# EAGLE design heliostat (EAGLE 7.3.0)
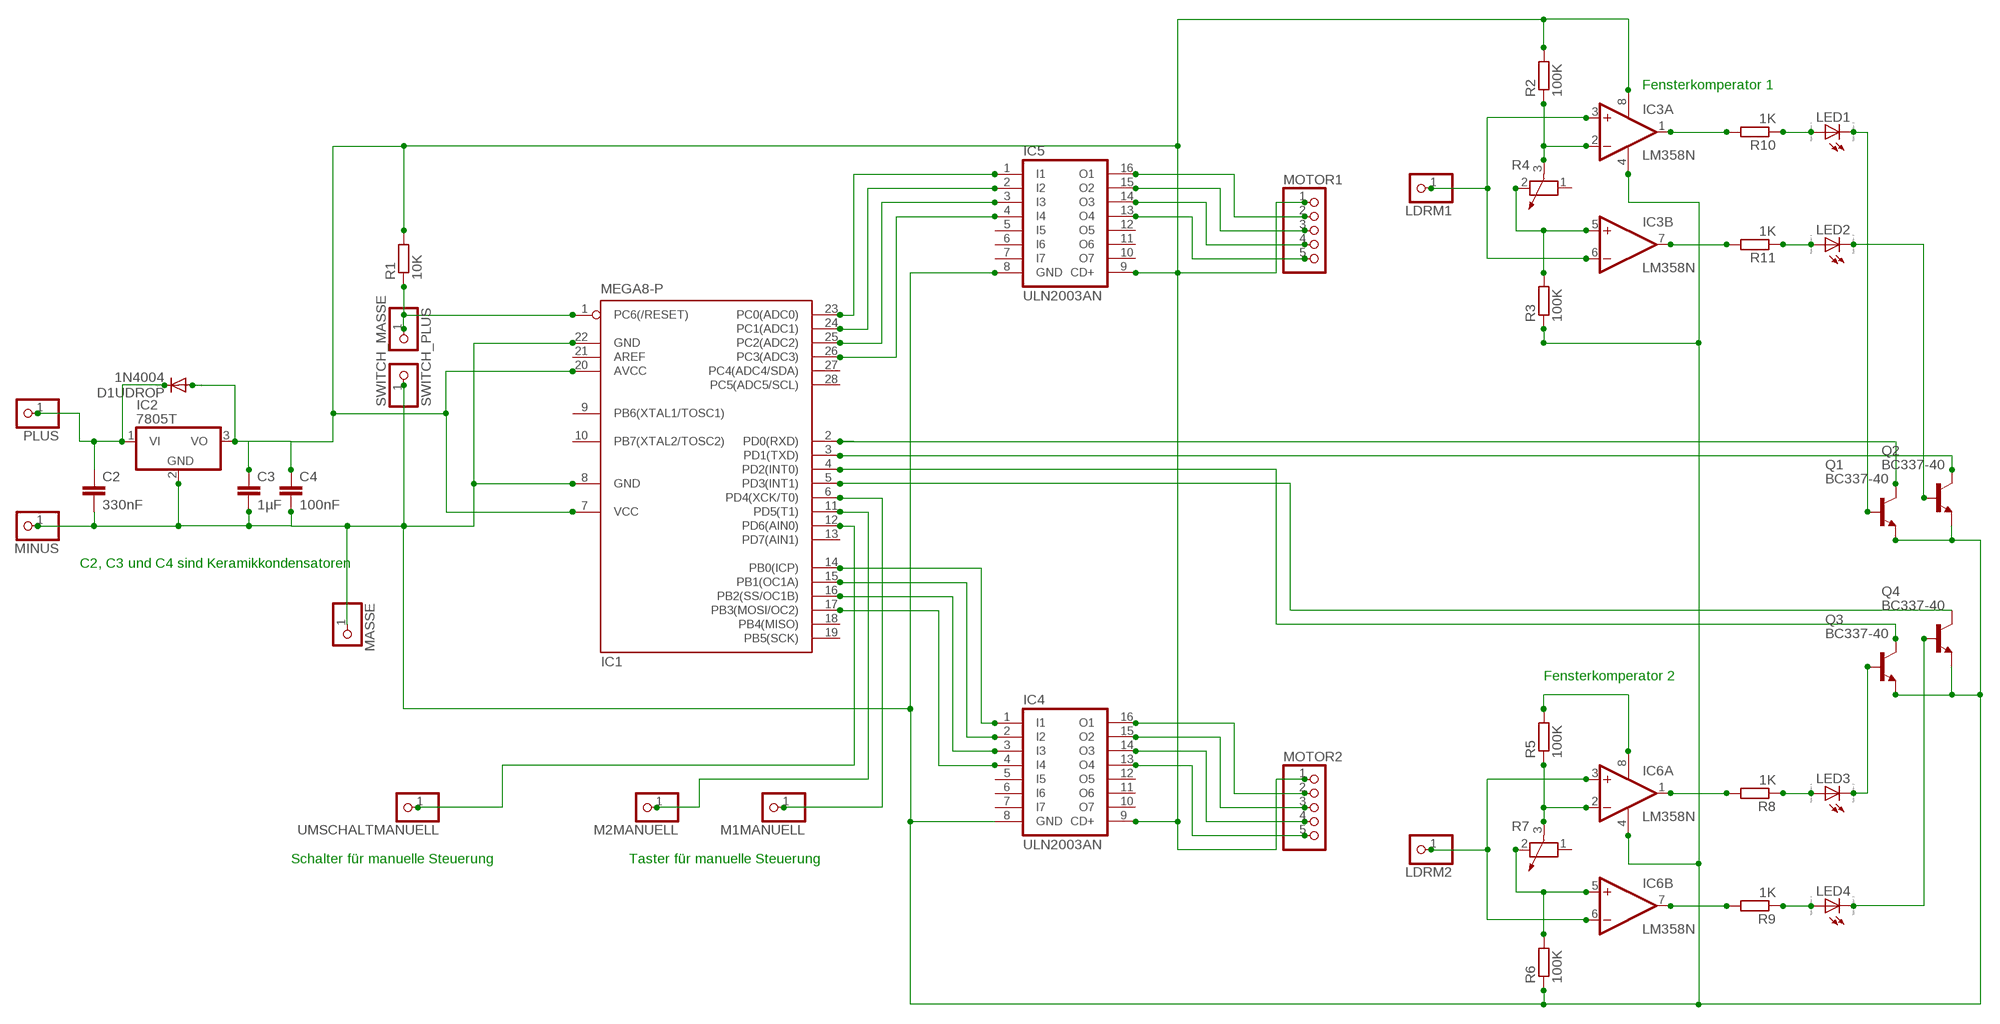
[diagram p0: schematic, sheet 1]

## Parts
C2  330nF  C-EU025-024X044  [C025-024X044]
C3  1µF  C-EU025-024X044  [C025-024X044]
C4  100nF  C-EU025-024X044  [C025-024X044]
D1UDROP  1N4004  [DO41-10]
IC1  MEGA8-P  [DIL28-3]
IC2  7805T  [TO220H]
IC3  LM358N  [DIL08]
IC4  ULN2003AN  [DIL16]
IC5  ULN2003AN  [DIL16]
IC6  LM358N  [DIL08]
LDRM1  PINHD-1X1  [1X01]
LDRM2  PINHD-1X1  [1X01]
LED1  LED_ELD260  [LED_LD260]
LED2  LED_ELD260  [LED_LD260]
LED3  LED_ELD260  [LED_LD260]
LED4  LED_ELD260  [LED_LD260]
M1MANUELL  PINHD-1X1  [1X01]
M2MANUELL  PINHD-1X1  [1X01]
MASSE  PINHD-1X1  [1X01]
MINUS  PINHD-1X1  [1X01]
MOTOR1  PINHD-1X5  [1X05]
MOTOR2  PINHD-1X5  [1X05]
PLUS  PINHD-1X1  [1X01]
Q1  BC337-40  [TO92]
Q2  BC337-40  [TO92]
Q3  BC337-40  [TO92]
Q4  BC337-40  [TO92]
R1  10K  R-EU_0204/2V  [0204V]
R2  100K  R-EU_0204/2V  [0204V]
R3  100K  R-EU_0204/2V  [0204V]
R4  POTENTIOMETER_PT-10  [PT-10]
R5  100K  R-EU_0204/2V  [0204V]
R6  100K  R-EU_0204/2V  [0204V]
R7  POTENTIOMETER_PT-10  [PT-10]
R8  1K  R-EU_0204/2V  [0204V]
R9  1K  R-EU_0204/2V  [0204V]
R10  1K  R-EU_0204/2V  [0204V]
R11  1K  R-EU_0204/2V  [0204V]
SWITCH_MASSE  PINHD-1X1  [1X01]
SWITCH_PLUS  PINHD-1X1  [1X01]
UMSCHALTMANUELL  PINHD-1X1  [1X01]

## Nets
N$1: IC1.23(PC0(ADC0)) IC5.1(I1)
N$2: IC3.2(A:-IN) R2.1 R4.3
N$3: IC1.24(PC1(ADC1)) IC5.2(I2)
N$4: C2.1 D1UDROP.C IC2.1(VI) PLUS.1
N$5: IC1.2(PD0(RXD)) Q1.3(C)
N$6: IC1.25(PC2(ADC2)) IC5.3(I3)
N$7: IC1.26(PC3(ADC3)) IC5.4(I4)
N$8: IC5.16(O1) MOTOR1.2
N$9: IC5.15(O2) MOTOR1.3
N$10: IC5.14(O3) MOTOR1.4
N$11: IC5.13(O4) MOTOR1.5
N$12: IC1.14(PB0(ICP)) IC4.1(I1)
N$13: IC1.15(PB1(OC1A)) IC4.2(I2)
N$14: IC1.16(PB2(SS/OC1B)) IC4.3(I3)
N$15: IC1.17(PB3(MOSI/OC2)) IC4.4(I4)
N$16: IC4.16(O1) MOTOR2.2
N$17: IC4.15(O2) MOTOR2.3
N$18: IC4.14(O3) MOTOR2.4
N$19: IC4.13(O4) MOTOR2.5
N$20: C3.1 C4.1 D1UDROP.A IC1.7(VCC) IC1.20(AVCC) IC2.3(VO) IC3.8(P:V+) IC4.9(CD+) IC5.9(CD+) MOTOR1.1 MOTOR2.1 R1.2 R2.2
N$21: IC3.5(B:+IN) R3.2 R4.2
N$22: IC6.8(P:V+) R5.2
N$23: IC3.3(A:+IN) IC3.6(B:-IN) LDRM1.1
N$24: IC6.1(A:OUT) R8.2
N$25: IC6.2(A:-IN) R5.1 R7.3
N$26: IC6.5(B:+IN) R6.2 R7.2
N$27: IC6.3(A:+IN) IC6.6(B:-IN) LDRM2.1
N$28: LED3.A R8.1
N$29: IC6.7(B:OUT) R9.2
N$30: LED4.A R9.1
N$31: IC3.7(B:OUT) R11.2
N$32: LED2.A R11.1
N$33: IC3.1(A:OUT) R10.2
N$34: LED1.A R10.1
N$35: IC1.1(PC6(/RESET)) R1.1 SWITCH_PLUS.1
N$36: IC1.6(PD4(XCK/T0)) M1MANUELL.1
N$37: LED1.K(C) Q1.2(B)
N$38: LED2.K(C) Q2.2(B)
N$39: IC1.3(PD1(TXD)) Q2.3(C)
N$40: LED3.K(C) Q3.2(B)
N$41: IC1.4(PD2(INT0)) Q3.3(C)
N$42: LED4.K(C) Q4.2(B)
N$43: IC1.5(PD3(INT1)) Q4.3(C)
N$44: IC1.11(PD5(T1)) M2MANUELL.1
N$45: C2.2 C3.2 C4.2 IC1.8(GND) IC1.22(GND) IC2.2(GND) IC3.4(P:V-) IC4.8(GND) IC5.8(GND) IC6.4(P:V-) MASSE.1 MINUS.1 Q1.1(E) Q2.1(E) Q3.1(E) Q4.1(E) R3.1 R6.1 SWITCH_MASSE.1
N$46: IC1.12(PD6(AIN0)) UMSCHALTMANUELL.1
Unconnected: IC1.9(PB6(XTAL1/TOSC1)) IC1.10(PB7(XTAL2/TOSC2)) IC1.13(PD7(AIN1)) IC1.18(PB4(MISO)) IC1.19(PB5(SCK)) IC1.21(AREF) IC1.27(PC4(ADC4/SDA)) IC1.28(PC5(ADC5/SCL)) IC4.5(I5) IC4.6(I6) IC4.7(I7) IC4.10(O7) IC4.11(O6) IC4.12(O5) IC5.5(I5) IC5.6(I6) IC5.7(I7) IC5.10(O7) IC5.11(O6) IC5.12(O5) R4.1 R7.1

## Notes on the sheet
- Fensterkomperator 1
- C2, C3 und C4 sind Keramikkondensatoren
- Fensterkomperator 2
- Schalter für manuelle Steuerung | Taster für manuelle Steuerung

## Library data of the parts
C2-C4 = rcl:C-EU: CAPACITOR, European symbol
D1UDROP = diode:1N4004: DIODE general purpose rectifier, 1 A
IC1 = atmel:MEGA8-P: MICROCONTROLLER 8 Kbytes FLASH, 1 kbytes SRAM, 512 bytes EEPROM, USART, 4-channel 10 bit ADC, 2-channel 8 bit ADC Pin compatible with Atmega48, ATMega88, ATMega168 Source: avr.lbr; OC_FARNELL: unknown; OC_NEWARK: unknown
IC2 = linear:78*: Positive VOLTAGE REGULATOR Source: http://cache.national.com/ds/LM/LM78L05.pdf http://www.fairchildsemi.com/ds/LM/LM7805.pdf
IC3 IC6 = linear:LM358: OP AMP also LM158; LM258; LM2904 Source: http://cache.national.com/ds/LM/LM158.pdf
IC4 IC5 = uln-udn:ULN2003A: DRIVER ARRAY
LDRM1 LDRM2 M1MANUELL M2MANUELL MASSE MINUS PLUS SWITCH_MASSE SWITCH_PLUS UMSCHALTMANUELL = pinhead:PINHD-1X1: PIN HEADER
LED1-LED4 = eagle-ltspice:LED_E: LED Source: http://www.osram.convergy.de Source: www.luxeon.com Source: www.kingbright.com; SPICEMODEL: NONE; SPICEPREFIX: D; SPICETYPE: diode
MOTOR1 MOTOR2 = pinhead:PINHD-1X5: PIN HEADER
Q1-Q4 = transistor-npn:BC337*: NPN Transistor
R1-R3 R5 R6 R8-R11 = resistor:R-EU_: RESISTOR, European symbol
R4 R7 = rcl:POTENTIOMETER_: Potentiometer

## Board
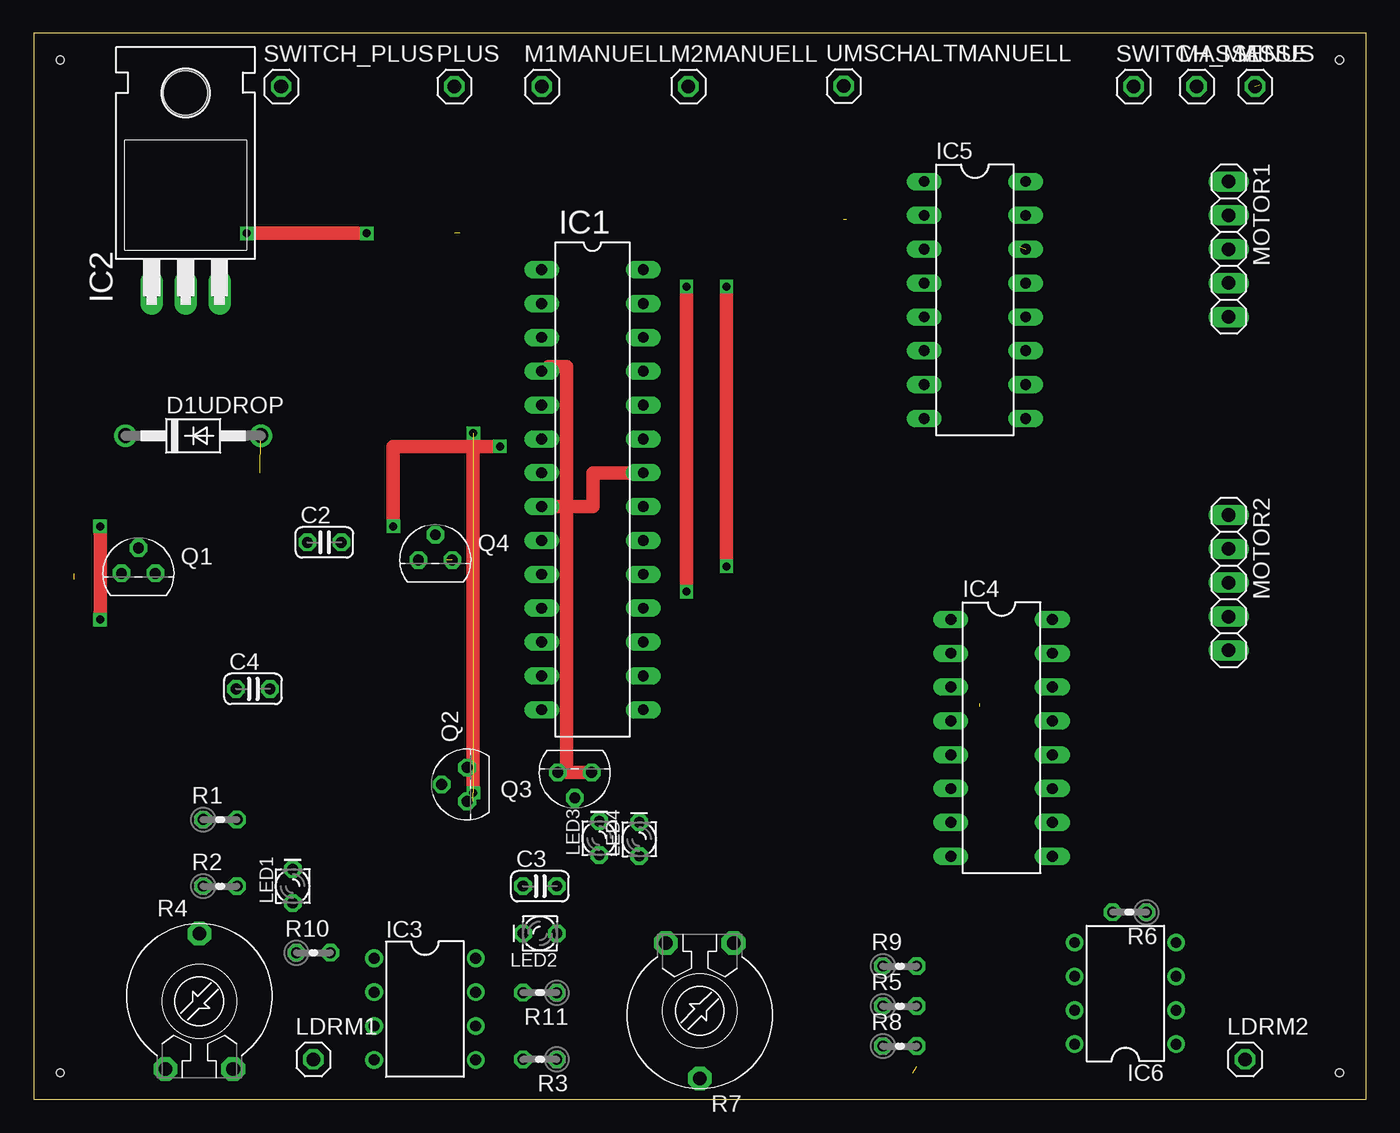
[diagram p1: board, top side]
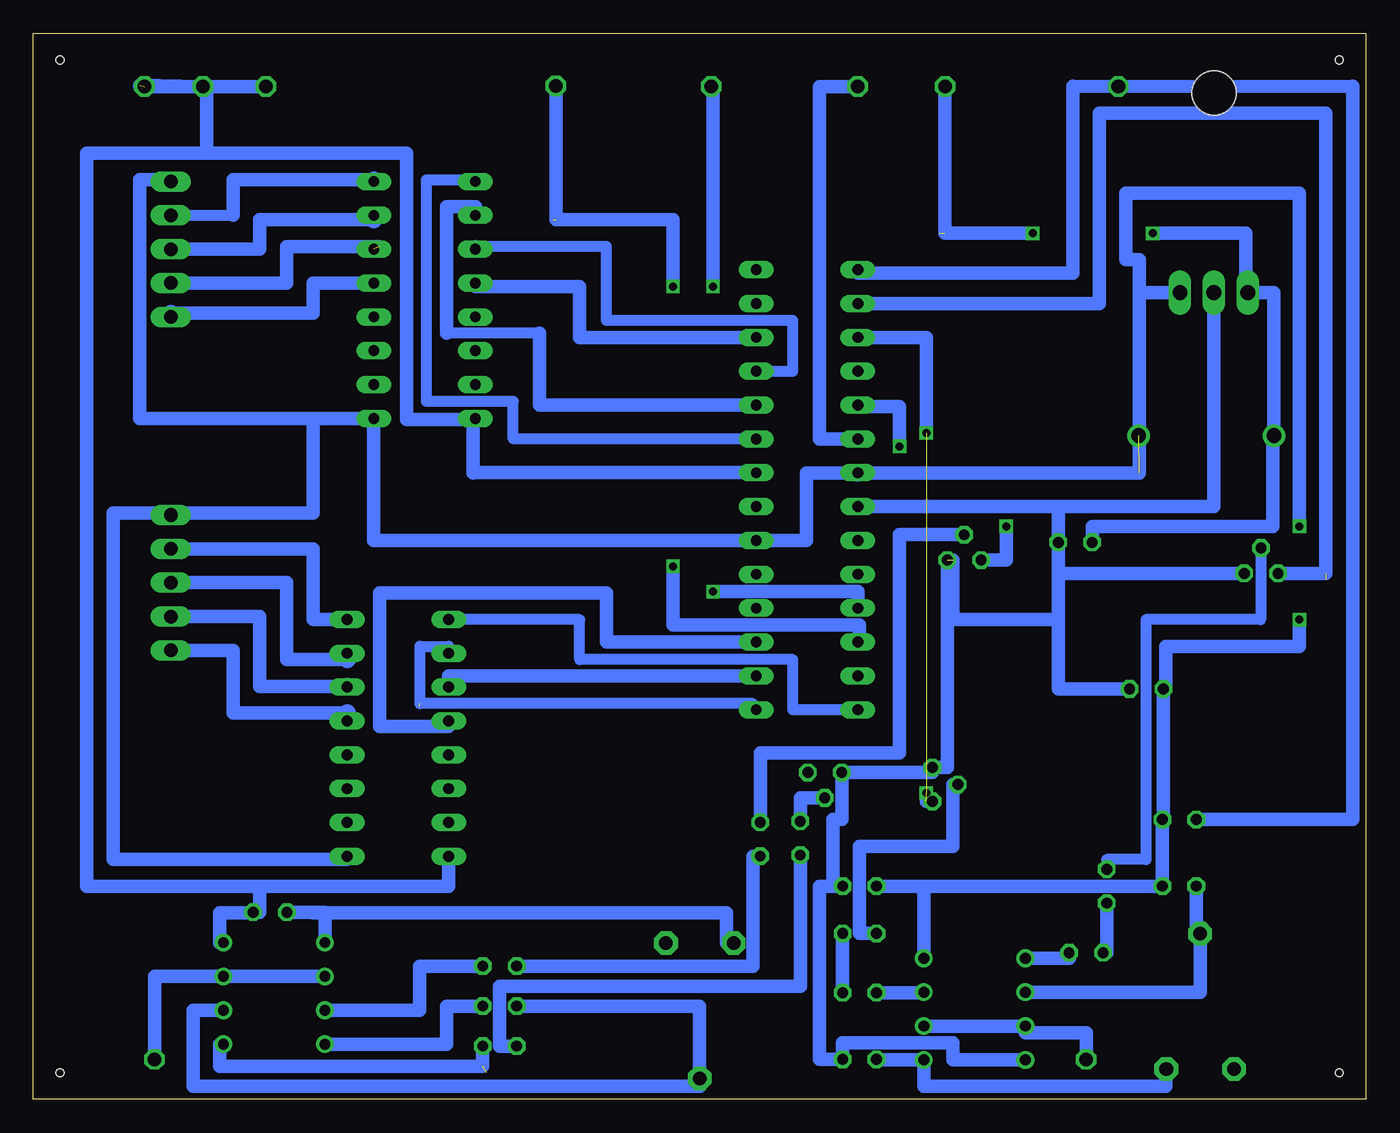
[diagram p2: board, bottom side, seen from below]

Size 100 x 80 mm. Coordinates in mm from the lower left corner, seen from the top.
Outline: 0,0 100,0 100,80 0,80 0,0
Copper layers (1*16): Top 0.035mm / dielectric 1.5mm / Bottom 0.035mm
Design rules "default": minimum track width 10mil, minimum drill 24mil, track to track 8mil, track to pad 8mil, pad to pad 8mil, via to via 8mil, smd to smd 8mil, copper to edge 40mil, drill to drill 8mil, minimum pad ring 10mil, minimum via ring 8mil, stop-mask expansion 4mil, vias tented up to drill 0mil, thermal gap 10mil
Holes 0.6 mm at 2,78 98,78 98,2 2,2

### Footprints (pad centres in the part's own frame; a part is rotated, then mirrored left to right if it is on the bottom)
C025-024X044 = drill 0.813 octagon: 1 -1.27,0; 2 1.27,0
DO41-10 = drill 1.118: A 5.08,0; C -5.08,0
DIL28-3 = drill 0.813 long: 1 -16.51,-3.81; 2 -13.97,-3.81; 3 -11.43,-3.81; 4 -8.89,-3.81; 5 -6.35,-3.81; 6 -3.81,-3.81; 7 -1.27,-3.81; 8 1.27,-3.81; 9 3.81,-3.81; 10 6.35,-3.81; 11 8.89,-3.81; 12 11.43,-3.81; 13 13.97,-3.81; 14 16.51,-3.81; 15 16.51,3.81; 16 13.97,3.81; 17 11.43,3.81; 18 8.89,3.81; 19 6.35,3.81; 20 3.81,3.81; 21 1.27,3.81; 22 -1.27,3.81; 23 -3.81,3.81; 24 -6.35,3.81; 25 -8.89,3.81; 26 -11.43,3.81; 27 -13.97,3.81; 28 -16.51,3.81
TO220H = drill 1.118 long: 1 -2.54,-10.16; 2 0,-10.16; 3 2.54,-10.16 | hole 3.302: 0,4.826
DIL08 = drill 0.813 pad 1.27: 1 -3.81,-3.81; 2 -1.27,-3.81; 3 1.27,-3.81; 4 3.81,-3.81; 5 3.81,3.81; 6 1.27,3.81; 7 -1.27,3.81; 8 -3.81,3.81
DIL16 = drill 0.813 long: 1 -8.89,-3.81; 2 -6.35,-3.81; 3 -3.81,-3.81; 4 -1.27,-3.81; 5 1.27,-3.81; 6 3.81,-3.81; 7 6.35,-3.81; 8 8.89,-3.81; 9 8.89,3.81; 10 6.35,3.81; 11 3.81,3.81; 12 1.27,3.81; 13 -1.27,3.81; 14 -3.81,3.81; 15 -6.35,3.81; 16 -8.89,3.81
1X01 = drill 1.016 octagon: 1 0,0
LED_LD260 = drill 0.813 octagon: A -1.27,0; K 1.27,0
1X05 = drill 1.016 long: 1 -5.08,0; 2 -2.54,0; 3 0,0; 4 2.54,0; 5 5.08,0
TO92 = drill 0.813 octagon: 1 1.27,0; 2 0,1.905; 3 -1.27,0
0204V = drill 0.813 octagon: 1 -1.27,0; 2 1.27,0
PT-10 = drill 1.016 pad 1.778 octagon: 1 -2.54,-5.08; 2 2.54,-5.08; 3 0,5.08

### Placement (x,y rotation side)
C2  21.82,41.8 0 top
C3  38,16 0 top
C4  16.47,30.8 0 top
D1UDROP  11.98,49.8 0 top
IC1  41.94,45.75 270 top
IC2  11.41,70.7 0 top
IC3  29.37,6.77 270 top
IC4  72.64,27.13 270 top
IC5  70.64,59.99 270 top
IC6  81.93,7.95 90 top
LDRM1  21,3 0 top
LDRM2  90.9,3 0 top
LED1  19.45,16 90 top
LED2  38,12.45 180 top
LED3  42.45,19.6 90 top
LED4  45.45,19.52 90 top
M1MANUELL  38.15,76 0 top
M2MANUELL  49.14,76 0 top
MASSE  87.28,76 0 top
MINUS  91.66,76 0 top
MOTOR1  89.69,63.8 270 top
MOTOR2  89.69,38.77 270 top
PLUS  31.58,76 0 top
Q1  7.87,39.47 0 top
Q2  32.53,23.63 90 top
Q3  40.61,24.53 180 top
Q4  30.15,40.47 0 top
R1  14,21 0 top
R2  14,16 0 top
R3  38,3 180 top
R4  12.44,7.35 0 top
R5  65,7 0 top
R6  82.24,14.04 180 top
R7  49.99,6.65 180 top
R8  65,4 0 top
R9  65,10 0 top
R10  21,11 0 top
R11  38,8 180 top
SWITCH_MASSE  82.55,76 0 top
SWITCH_PLUS  18.58,76 0 top
UMSCHALTMANUELL  60.79,76.04 0 top

### Tracks (layer width: path | path; a pad name or v marks a point on that pad's centre or on a via)
N$1
  Bottom 0.813: IC1.23 64,49.56 64,52.37 70.5,52.37 70.5,69 66.83,69
  Bottom 1.016: 66.83,69 IC5.1
N$2
  Bottom 1.016: R2.1 12.73,12.43 R4.3 12.44,8.04 IC3.2
N$3
  Bottom 0.813: 62,57.5 69,57.5
  Bottom 1.016: IC1.24 62,52.1 62,57.5 | 69,57.5 69,67 66.83,67 IC5.2
N$4  (via drill 0.6)  (1 unrouted)
  Top 1.016: v16,65 v25,65
  Bottom 1.016: C2.1 20.55,43 7,43 7,49.8 D1UDROP.C 6.9,60.54 IC2.1 9,60.54 9,65 v16,65 | v25,65 31.58,65 PLUS.1
N$5  (1 unrouted)
  Bottom 1.016: IC1.2 20,59.72 20,74 3,74 3,39.47 Q1.3
N$6
  Bottom 0.813: IC1.25 43,54.64 43,58.45 57,58.45 57,64 66.83,64
  Bottom 1.016: 66.83,64 IC5.3
N$7
  Bottom 1.016: IC1.26 59,57.18 59,61 66.83,61 IC5.4
N$8
  Bottom 0.813: MOTOR1.2 85,66.34
  Bottom 1.016: 85,66.34 85,69 74.45,69
  Bottom 1.27: 74.45,69 IC5.16
N$9
  Bottom 1.016: MOTOR1.3 83,63.8 83,66 74.45,66
  Bottom 1.27: 74.45,66 IC5.15
N$10  (1 unrouted)
  Bottom 1.016: MOTOR1.4 81,61.26 81,64 74,64
N$11
  Bottom 1.016: IC5.13 79,61.26 79,59 89.69,59
  Bottom 1.27: 89.69,59 MOTOR1.5
N$12
  Bottom 0.813: IC1.14 43,29.24 43,33 59,33 59,36 68.83,36
  Bottom 1.016: 68.83,36 IC4.1
N$13  (1 unrouted)
  Bottom 0.813: IC4.2 68.83,34 71,34 71,29.7 46,29.7 46,29.24 IC1.15
N$14
  Bottom 1.016: IC1.16 68.83,31.78 IC4.3
N$15
  Bottom 1.016: IC1.17 57,34.32 57,38 74,38 74,28 68.83,28 IC4.4
N$16
  Bottom 1.016: MOTOR2.2 79,41.31 79,36 76.45,36
  Bottom 1.27: 76.45,36 IC4.16
N$17
  Bottom 1.016: MOTOR2.3 81,38.77 81,33 76.45,33
  Bottom 1.27: 76.45,33 IC4.15
N$18
  Bottom 1.016: MOTOR2.4 83,36.23 83,31 76.45,31
  Bottom 1.27: 76.45,31 IC4.14
N$19
  Bottom 1.016: MOTOR2.5 85,33.69 85,29 76.45,29
  Bottom 1.27: 76.45,29 IC4.13
N$20  (via drill 0.6)  (1 unrouted)
  Top 1.016: v5,43 v5,36
  Bottom 1.016: 79,51.1 IC5.9 74.45,41.94 IC1.20 42,41.94 42,47 38.13,47 17,47 17,60.54 | 79,51.1 79,44 89.69,44 94,44 94,18 76.45,18 IC4.9 | 79,51.1 92,51.1 92,69 89.69,69 | IC2.3 17,60.54 | 33.18,16 R2.2 R1.2 15.2,21 C4.1 15,30.8 15,34 5,34 v5,36 | 33.18,16 IC3.8 | C3.1 33.18,16 | 17,60.54 17,63 18,63 18,68 5,68 v5,43
  Bottom 1.27: 89.69,44 MOTOR2.1 | 89.69,69 MOTOR1.1 | 38.13,47 IC1.7
N$21
  Bottom 1.016: R4.2 15,2.27 15,1 33.18,1 IC3.5 36.73,2.96 R3.2
N$22
  Bottom 1.016: IC6.8 69,4.14 69,7 R5.2
N$23
  Bottom 1.016: LDRM1.1 21,5 25.56,5 IC3.3 IC3.6
N$24  (1 unrouted)
  Bottom 1.016: IC6.1 86,4.14 86,2.5 66.27,2.5 R8.2
N$25
  Bottom 1.016: R5.1 50,7 R7.3 49.99,1 88,1 88,6.68 IC6.2
N$26
  Bottom 1.016: R6.2 79,14.04 | 79,14.04 78.12,14.04 IC6.5 | 79,14.04 79,14 48,14 48,11.73 R7.2
N$27
  Bottom 1.016: IC6.6 IC6.3 90.9,9.22 LDRM2.1
N$28
  Bottom 1.016: R8.1 65,4 65,8.5 42.45,8.5 LED3.A
N$29
  Bottom 1.016: IC6.7 71,6.68 71,10 R9.2
N$30
  Bottom 1.016: LED4.A 46,18.25 46,10 R9.1
N$31
  Bottom 1.016: R11.2 33.18,8 IC3.7
N$32
  Bottom 1.016: LED2.A R11.1
N$33
  Bottom 1.016: IC3.1 22.27,10.58 R10.2
N$34
  Bottom 1.016: R10.1 19.45,11 LED1.A
N$35
  Bottom 1.016: IC1.1 38.13,62 22,62 22,76.04 SWITCH_PLUS.1 1,76.04 1,21 R1.1
N$36
  Bottom 1.016: IC1.6 41,49.56 41,76 M1MANUELL.1
N$37
  Bottom 0.813: Q1.2 7.9,41.38 7.9,36 16.5,36 16.5,18 19.45,18 LED1.K
N$38
  Bottom 1.016: LED2.K 38,12.45 38,19 31,19 31,23.63 Q2.2
N$39  (via drill 0.6)  (3 unrouted)
  Top 1.016: v33,23 v33,50
  Bottom 1.016: IC1.3 33,57.18 v33,50 | Q2.3 33,22.36 v33,23
N$40
  Bottom 1.016: Q3.2 42.45,22.62 LED3.K
N$41
  Top 1.016: Q3.3 40,24.53 40,55 38.63,55 38.63,54.64 IC1.4
N$42
  Bottom 1.016: Q4.2 35,42.38 35,26 45.45,26 LED4.K
N$43  (via drill 0.6)
  Top 1.016: v27,43 27,49 v35,49
  Bottom 1.016: Q4.3 27,40.47 v27,43 | v35,49 35,52 38.13,52 IC1.5
N$44  (via drill 0.6)
  Top 1.016: v49,61 v49,38.1
  Bottom 1.016: M2MANUELL.1 49,76.12 v49,61 | v49,38.1 38.13,38.1 IC1.11
N$45  (2 unrouted)
  Top 1.016: IC1.8 42,44.48 42,47 45.75,47 IC1.22
  Bottom 1.016: IC1.22 66.98,47.02 67,47 67,50.93 IC5.8 66.83,51 72,51 72,71 87,71 | IC6.4 86,11.76 86,14 83.51,14 R6.1 83,14.04 83,16 | 83,16 68.83,16 IC4.8 | 68.83,18 IC4.8 | IC4.8 69,18.24 | 87,71 96,71 96,16 83,16 | 87,71 87,76.12 MASSE.1 92,76.12 92,76 SWITCH_MASSE.1 | IC1.8 23.09,44.48 | IC2.2 11.41,44.48 23.09,44.48 | IC3.4 31,2.96 31,4.25 39.27,4.25 R3.1 41,3 41,16 C3.2 40,16 40,21 39.34,21 Q3.1 32.53,24.53 Q2.1 31.42,24.9 Q4.1 | C4.2 23.09,30.8 23.09,36 | 23.09,36 23.09,39.47 | 23.09,39.47 C2.2 23.09,44.48 | 23.09,36 31,36 31,40.47 | Q1.1 23.09,39.47
N$46  (via drill 0.6)  (1 unrouted)
  Top 1.016: v52,40 v52,61
  Bottom 1.016: IC1.12 38,34.32 38,35.6 52,35.6 v52,40 | v52,61 52,66 60.79,66 UMSCHALTMANUELL.1